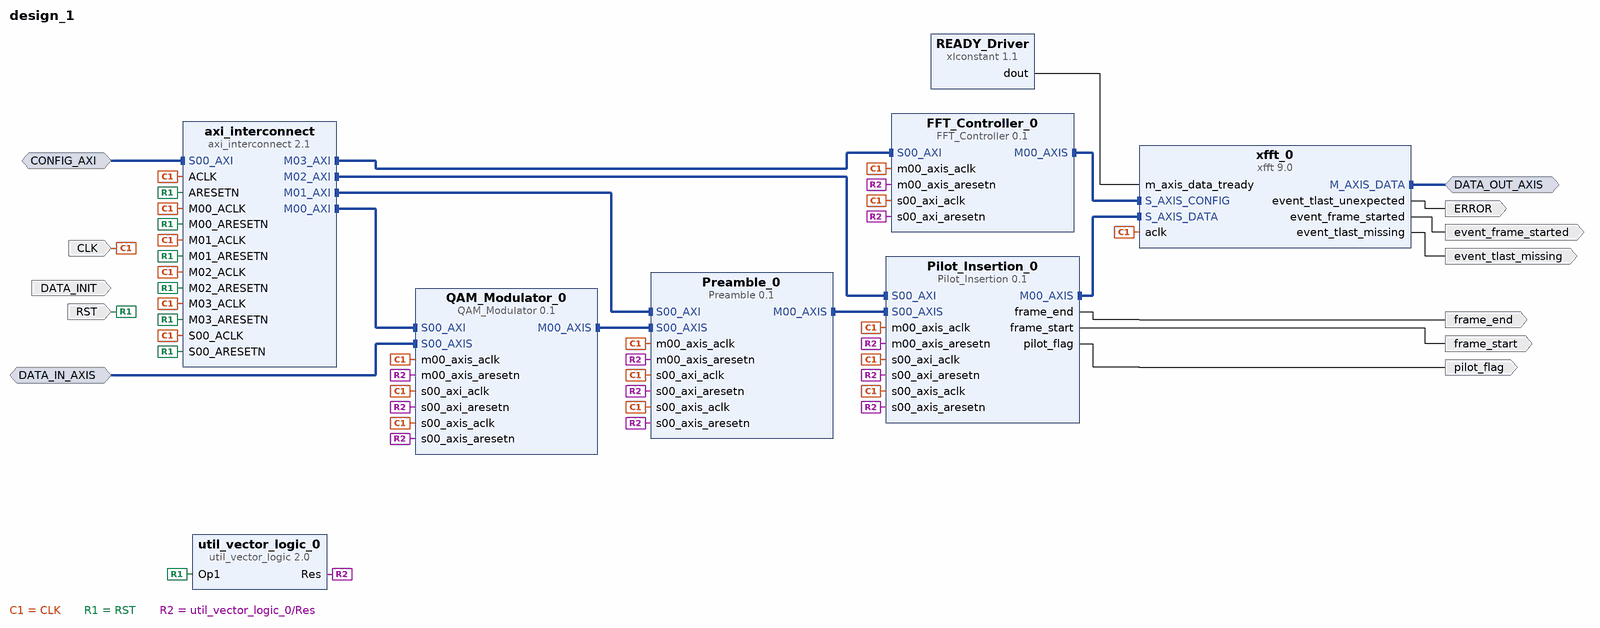
[diagram p0: block diagram of the top level]
# Vivado block design design_1, xc7z020clg484-1, Vivado 2016.4
create_bd_design design_1

create_bd_intf_port -mode Slave -vlnv xilinx.com:interface:aximm_rtl:1.0 CONFIG_AXI
set_property -dict [list \
  CONFIG.DATA_WIDTH 32 \
  CONFIG.PROTOCOL AXI4LITE \
  CONFIG.ID_WIDTH 0 \
  CONFIG.ADDR_WIDTH 15 \
  CONFIG.AWUSER_WIDTH 0 \
  CONFIG.ARUSER_WIDTH 0 \
  CONFIG.WUSER_WIDTH 0 \
  CONFIG.RUSER_WIDTH 0 \
  CONFIG.BUSER_WIDTH 0 \
  CONFIG.READ_WRITE_MODE READ_WRITE \
  CONFIG.HAS_BURST 0 \
  CONFIG.HAS_LOCK 0 \
  CONFIG.HAS_PROT 1 \
  CONFIG.HAS_CACHE 0 \
  CONFIG.HAS_QOS 0 \
  CONFIG.HAS_REGION 0 \
  CONFIG.HAS_WSTRB 1 \
  CONFIG.HAS_BRESP 1 \
  CONFIG.HAS_RRESP 1 \
  CONFIG.SUPPORTS_NARROW_BURST 0 \
  CONFIG.NUM_READ_OUTSTANDING 1 \
  CONFIG.NUM_WRITE_OUTSTANDING 1 \
  CONFIG.MAX_BURST_LENGTH 1 \
  CONFIG.NUM_READ_THREADS 1 \
  CONFIG.NUM_WRITE_THREADS 1 \
  CONFIG.RUSER_BITS_PER_BYTE 0 \
  CONFIG.WUSER_BITS_PER_BYTE 0 \
] [get_bd_intf_ports CONFIG_AXI]
create_bd_intf_port -mode Slave -vlnv xilinx.com:interface:axis_rtl:1.0 DATA_IN_AXIS
set_property -dict [list \
  CONFIG.TDATA_NUM_BYTES 4 \
  CONFIG.TDEST_WIDTH 0 \
  CONFIG.TID_WIDTH 0 \
  CONFIG.TUSER_WIDTH 0 \
  CONFIG.HAS_TREADY 1 \
  CONFIG.HAS_TSTRB 0 \
  CONFIG.HAS_TKEEP 0 \
  CONFIG.HAS_TLAST 0 \
  CONFIG.LAYERED_METADATA undef \
] [get_bd_intf_ports DATA_IN_AXIS]
create_bd_intf_port -mode Master -vlnv xilinx.com:interface:axis_rtl:1.0 DATA_OUT_AXIS
create_bd_port -dir I -type clk CLK
set_property -dict [list \
  CONFIG.FREQ_HZ 100000000 \
  CONFIG.ASSOCIATED_BUSIF DATA_IN_AXIS:QAM_OUT_AXIS:CONFIG_AXI:DATA_OUT_AXIS:QAM_IN_AXIS \
] [get_bd_ports CLK]
create_bd_port -dir I RST
create_bd_port -dir O pilot_flag
create_bd_port -dir O ERROR
create_bd_port -dir O -type intr event_frame_started
create_bd_port -dir O -type intr event_tlast_missing
create_bd_port -dir I DATA_INIT
create_bd_port -dir O frame_start
create_bd_port -dir O frame_end

create_bd_cell -type ip -vlnv xilinx.com:ip:axi_interconnect:2.1 axi_interconnect
set_property -dict {CONFIG.NUM_MI 4} [get_bd_cells axi_interconnect]
create_bd_cell -type ip -vlnv xilinx.com:ip:util_vector_logic:2.0 util_vector_logic_0
set_property -dict {CONFIG.C_SIZE 1 CONFIG.C_OPERATION not} [get_bd_cells util_vector_logic_0]
create_bd_cell -type ip -vlnv xilinx.com:ip:xlconstant:1.1 READY_Driver
create_bd_cell -type ip -vlnv user.org:user:Preamble:0.1 Preamble_0
create_bd_cell -type ip -vlnv xilinx.com:ip:xfft:9.0 xfft_0
set_property -dict [list \
  CONFIG.transform_length 512 \
  CONFIG.implementation_options pipelined_streaming_io \
  CONFIG.run_time_configurable_transform_length true \
  CONFIG.number_of_stages_using_block_ram_for_data_and_phase_factors 2 \
] [get_bd_cells xfft_0]
create_bd_cell -type ip -vlnv user.org:user:FFT_Controller:0.1 FFT_Controller_0
create_bd_cell -type ip -vlnv user.org:user:Pilot_Insertion:0.1 Pilot_Insertion_0
create_bd_cell -type ip -vlnv user.org:user:QAM_Modulator:0.1 QAM_Modulator_0

# ---- connections ----

connect_bd_intf_net [get_bd_intf_pins Preamble_0/S00_AXI] [get_bd_intf_pins axi_interconnect/M01_AXI]
connect_bd_intf_net [get_bd_intf_pins Preamble_0/M00_AXIS] [get_bd_intf_pins Pilot_Insertion_0/S00_AXIS]
connect_bd_intf_net [get_bd_intf_pins Pilot_Insertion_0/S00_AXI] [get_bd_intf_pins axi_interconnect/M02_AXI]
connect_bd_intf_net [get_bd_intf_pins Pilot_Insertion_0/M00_AXIS] [get_bd_intf_pins xfft_0/S_AXIS_DATA]
connect_bd_intf_net [get_bd_intf_pins FFT_Controller_0/M00_AXIS] [get_bd_intf_pins xfft_0/S_AXIS_CONFIG]
connect_bd_intf_net [get_bd_intf_pins FFT_Controller_0/S00_AXI] [get_bd_intf_pins axi_interconnect/M03_AXI]
connect_bd_intf_net [get_bd_intf_pins QAM_Modulator_0/M00_AXIS] [get_bd_intf_pins Preamble_0/S00_AXIS]
connect_bd_intf_net [get_bd_intf_pins QAM_Modulator_0/S00_AXI] [get_bd_intf_pins axi_interconnect/M00_AXI]
connect_bd_intf_net [get_bd_intf_ports CONFIG_AXI] [get_bd_intf_pins axi_interconnect/S00_AXI]
connect_bd_intf_net [get_bd_intf_ports DATA_IN_AXIS] [get_bd_intf_pins QAM_Modulator_0/S00_AXIS]
connect_bd_intf_net [get_bd_intf_ports DATA_OUT_AXIS] [get_bd_intf_pins xfft_0/M_AXIS_DATA]
connect_bd_net -net processing_system7_0_FCLK_CLK0 [get_bd_ports CLK] \
  [get_bd_pins Preamble_0/m00_axis_aclk] [get_bd_pins Preamble_0/s00_axis_aclk] [get_bd_pins Preamble_0/s00_axi_aclk] \
  [get_bd_pins FFT_Controller_0/s00_axi_aclk] [get_bd_pins FFT_Controller_0/m00_axis_aclk] [get_bd_pins xfft_0/aclk] \
  [get_bd_pins axi_interconnect/ACLK] [get_bd_pins axi_interconnect/S00_ACLK] [get_bd_pins axi_interconnect/M00_ACLK] \
  [get_bd_pins axi_interconnect/M01_ACLK] [get_bd_pins axi_interconnect/M02_ACLK] [get_bd_pins axi_interconnect/M03_ACLK] \
  [get_bd_pins Pilot_Insertion_0/m00_axis_aclk] [get_bd_pins Pilot_Insertion_0/s00_axis_aclk] \
  [get_bd_pins Pilot_Insertion_0/s00_axi_aclk] [get_bd_pins QAM_Modulator_0/s00_axi_aclk] \
  [get_bd_pins QAM_Modulator_0/s00_axis_aclk] [get_bd_pins QAM_Modulator_0/m00_axis_aclk]
connect_bd_net -net ARESETN_1 [get_bd_ports RST] \
  [get_bd_pins util_vector_logic_0/Op1] [get_bd_pins axi_interconnect/ARESETN] [get_bd_pins axi_interconnect/S00_ARESETN] \
  [get_bd_pins axi_interconnect/M00_ARESETN] [get_bd_pins axi_interconnect/M01_ARESETN] \
  [get_bd_pins axi_interconnect/M02_ARESETN] [get_bd_pins axi_interconnect/M03_ARESETN]
connect_bd_net [get_bd_pins util_vector_logic_0/Res] \
  [get_bd_pins Preamble_0/m00_axis_aresetn] [get_bd_pins Preamble_0/s00_axis_aresetn] \
  [get_bd_pins Preamble_0/s00_axi_aresetn] [get_bd_pins FFT_Controller_0/s00_axi_aresetn] \
  [get_bd_pins FFT_Controller_0/m00_axis_aresetn] [get_bd_pins Pilot_Insertion_0/m00_axis_aresetn] \
  [get_bd_pins Pilot_Insertion_0/s00_axis_aresetn] [get_bd_pins Pilot_Insertion_0/s00_axi_aresetn] \
  [get_bd_pins QAM_Modulator_0/s00_axi_aresetn] [get_bd_pins QAM_Modulator_0/s00_axis_aresetn] \
  [get_bd_pins QAM_Modulator_0/m00_axis_aresetn]
connect_bd_net [get_bd_pins Pilot_Insertion_0/pilot_flag] [get_bd_ports pilot_flag]
connect_bd_net [get_bd_pins READY_Driver/dout] [get_bd_pins xfft_0/m_axis_data_tready]
connect_bd_net [get_bd_pins xfft_0/event_tlast_unexpected] [get_bd_ports ERROR]
connect_bd_net [get_bd_pins xfft_0/event_frame_started] [get_bd_ports event_frame_started]
connect_bd_net [get_bd_pins xfft_0/event_tlast_missing] [get_bd_ports event_tlast_missing]
connect_bd_net [get_bd_pins Pilot_Insertion_0/frame_start] [get_bd_ports frame_start]
connect_bd_net [get_bd_pins Pilot_Insertion_0/frame_end] [get_bd_ports frame_end]

# ---- address map ----
assign_bd_address -offset 0x0000 -range 4K -target_address_space [get_bd_addr_spaces CONFIG_AXI] [get_bd_addr_segs Preamble_0/S00_AXI/S00_AXI_reg]
assign_bd_address -offset 0x1000 -range 4K -target_address_space [get_bd_addr_spaces CONFIG_AXI] [get_bd_addr_segs QAM_Modulator_0/S00_AXI/S00_AXI_reg]
assign_bd_address -offset 0x2000 -range 4K -target_address_space [get_bd_addr_spaces CONFIG_AXI] [get_bd_addr_segs Pilot_Insertion_0/S00_AXI/S00_AXI_reg]
assign_bd_address -offset 0x3000 -range 4K -target_address_space [get_bd_addr_spaces CONFIG_AXI] [get_bd_addr_segs FFT_Controller_0/S00_AXI/S00_AXI_reg]

validate_bd_design
save_bd_design
